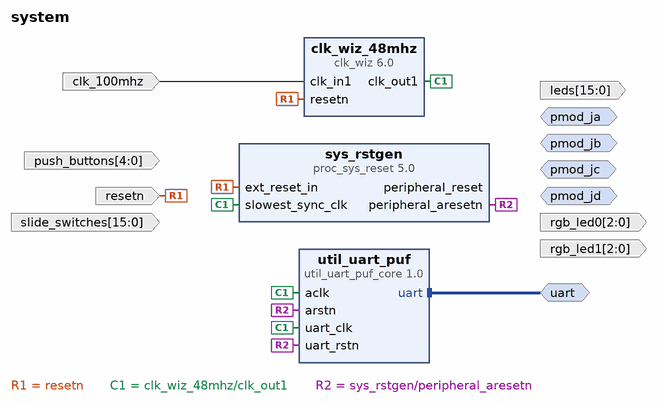
[diagram p0: block diagram of the top level]
# Vivado block design system, xc7a100tcsg324-1, Vivado 2020.2
create_bd_design system

create_bd_intf_port -mode Master -vlnv digilentinc.com:interface:pmod_rtl:1.0 pmod_ja
create_bd_intf_port -mode Master -vlnv digilentinc.com:interface:pmod_rtl:1.0 pmod_jb
create_bd_intf_port -mode Master -vlnv digilentinc.com:interface:pmod_rtl:1.0 pmod_jc
create_bd_intf_port -mode Master -vlnv digilentinc.com:interface:pmod_rtl:1.0 pmod_jd
create_bd_intf_port -mode Master -vlnv xilinx.com:interface:uart_rtl:1.0 uart
create_bd_port -dir I -type clk clk_100mhz
set_property -dict {CONFIG.FREQ_HZ 100000000} [get_bd_ports clk_100mhz]
create_bd_port -dir I -type rst resetn
set_property -dict {CONFIG.POLARITY ACTIVE_LOW} [get_bd_ports resetn]
create_bd_port -dir O -from 15 -to 0 leds
create_bd_port -dir O -from 2 -to 0 rgb_led0
create_bd_port -dir O -from 2 -to 0 rgb_led1
create_bd_port -dir I -from 4 -to 0 push_buttons
create_bd_port -dir I -from 15 -to 0 slide_switches

create_bd_cell -type ip -vlnv xilinx.com:ip:clk_wiz:6.0 clk_wiz_48mhz
set_property -dict [list \
  CONFIG.CLKOUT1_REQUESTED_OUT_FREQ 48 \
  CONFIG.PRIMITIVE MMCM \
  CONFIG.PRIM_IN_FREQ 100.000 \
  CONFIG.RESET_PORT resetn \
  CONFIG.RESET_TYPE ACTIVE_LOW \
  CONFIG.USE_LOCKED false \
  CONFIG.USE_RESET true \
] [get_bd_cells clk_wiz_48mhz]
create_bd_cell -type ip -vlnv xilinx.com:ip:proc_sys_reset:5.0 sys_rstgen
set_property -dict {CONFIG.C_EXT_RST_WIDTH 1} [get_bd_cells sys_rstgen]
create_bd_cell -type ip -vlnv afrl.mil:user:util_uart_puf_core:1.0 util_uart_puf
set_property -dict [list \
  CONFIG.clock_speed 48000000 \
  CONFIG.uart_baud_clock_speed 48000000 \
  CONFIG.uart_baud_rate 115200 \
  CONFIG.uart_parity_ena 0 \
  CONFIG.uart_rx_delay 4 \
  CONFIG.uart_tx_delay 4 \
] [get_bd_cells util_uart_puf]

# ---- connections ----

connect_bd_intf_net [get_bd_intf_ports uart] [get_bd_intf_pins util_uart_puf/uart]
connect_bd_net [get_bd_ports resetn] [get_bd_pins sys_rstgen/ext_reset_in] [get_bd_pins clk_wiz_48mhz/resetn]
connect_bd_net [get_bd_ports clk_100mhz] [get_bd_pins clk_wiz_48mhz/clk_in1]
connect_bd_net -net sys_clk [get_bd_pins clk_wiz_48mhz/clk_out1] \
  [get_bd_pins sys_rstgen/slowest_sync_clk] [get_bd_pins util_uart_puf/aclk] [get_bd_pins util_uart_puf/uart_clk]
# net sys_reset has one end: sys_rstgen/peripheral_reset
connect_bd_net -net sys_resetn [get_bd_pins sys_rstgen/peripheral_aresetn] [get_bd_pins util_uart_puf/arstn] [get_bd_pins util_uart_puf/uart_rstn]

validate_bd_design
save_bd_design
